# Altium project gilbertcell_TEST_V1.PrjPcb
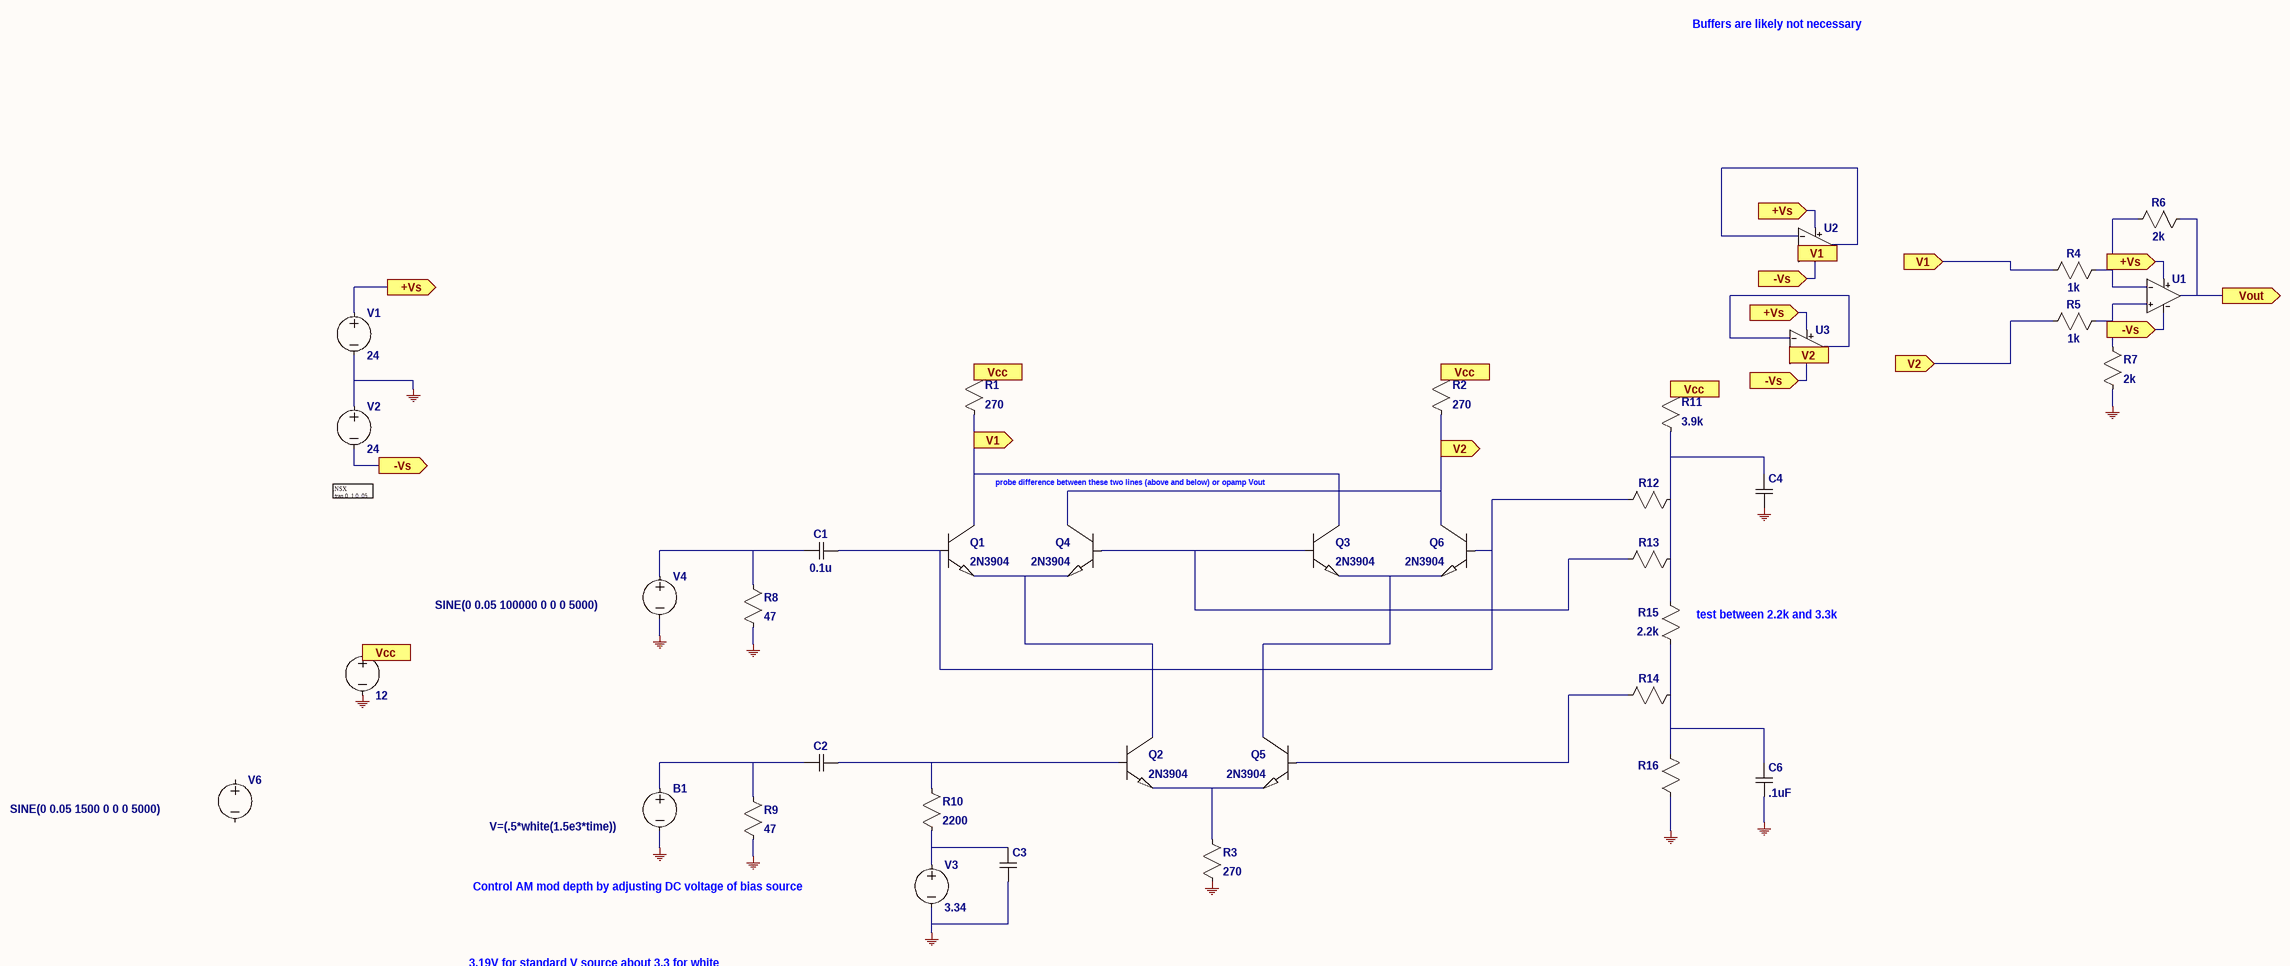
[diagram p0: gilbertcell_TEST_V1.SchDoc]
1 sheet, 37 parts. Net scope: flat (ports and power ports of the same name join across sheets).
Board file: RADIO.PcbDoc

## Sheet gilbertcell_TEST_V1.SchDoc
size 1141 x 419 mm

### Parts
B1  V=(.5*white(1.5e3*time))
C1  0.1u
C2  0.1u  (value not drawn)
C3  0.1u  (value not drawn)
C4  0.1u  (value not drawn)
C6  .1uF
Q1  2N3904
Q2  2N3904
Q3  2N3904
Q4  2N3904
Q5  2N3904
Q6  2N3904
R1  270
R2  270
R3  270
R4  1k
R5  1k
R6  2k
R7  2k
R8  47
R9  47
R10  2200
R11  3.9k
R12  2200  (value not drawn)
R13  2200  (value not drawn)
R14  2200  (value not drawn)
R15  2.2k
R16  2200  (value not drawn)
U1  Value  (value not drawn)
U2  Value  (value not drawn)
U3  Value  (value not drawn)
V1  24
V2  24
V3  3.34
V4  SINE(0 0.05 100000 0 0 0 5000)
V5  12
V6  SINE(0 0.05 1500 0 0 0 5000)

### Ports
+Vs (in), +Vs (out), -Vs (in), -Vs (out), V1 (in), V1 (out), V2 (in), V2 (out), Vcc (in), Vcc (out), Vout (out)

### Nets
GND: B1.2(-) C3.2(B) C4.2(B) C6.2(B) R3.2(B) R7.2(B) R8.2(B) R9.2(B) R16.1(A) V1.2(-) V2.1(+) V3.2(-) V4.2(-) V5.2(-)
NetB1_1: B1.1(+) C2.2(B) R9.1(A)
NetC1_1: C1.1(A) Q1.2(B) Q6.2(B) R12.2(B)
NetC1_2: C1.2(B) R8.1(A) V4.1(+)
NetC2_1: C2.1(A) Q2.2(B) R10.1(A)
NetC3_1: C3.1(A) R10.2(B) V3.1(+)
NetC4_1: C4.1(A) R11.2(B) R12.1(A) R13.1(A) R15.2(B)
NetC6_1: C6.1(A) R14.1(A) R15.1(A) R16.2(B)
NetQ1_1: Q1.1(C) Q3.1(C) R1.2(B) R4.2(B) U2.1(In+) ; port V1
NetQ1_3: Q1.3(E) Q2.1(C) Q4.3(E)
NetQ2_3: Q2.3(E) Q5.3(E) R3.1(A)
NetQ3_2: Q3.2(B) Q4.2(B) R13.2(B)
NetQ3_3: Q3.3(E) Q5.1(C) Q6.3(E)
NetQ4_1: Q4.1(C) Q6.1(C) R2.2(B) R5.2(B) U3.1(In+) ; port V2
NetQ5_2: Q5.2(B) R14.2(B)
NetR1_1: R1.1(A) R2.1(A) R11.1(A) V5.1(+) ; port Vcc
NetR4_1: R4.1(A) R6.2(B) U1.2(In-)
NetR5_1: R5.1(A) R7.1(A) U1.1(In+)
NetR6_1: R6.1(A) U1.5(OUT) ; port Vout
NetU1_3: U1.3(V+) U2.3(V+) U3.3(V+) V1.1(+) ; port +Vs
NetU1_4: U1.4(V-) U2.4(V-) U3.4(V-) V2.2(-) ; port -Vs
NetU2_2: U2.2(In-) U2.5(OUT)
NetU3_2: U3.2(In-) U3.5(OUT)

Not connected (* = marked no-connect by the designer): V6 1(+) 2(-)

### Notes on the sheet
- Buffers are likely not necessary
- probe difference between these two lines (above and below) or opamp Vout
- .NSX
  .tran 0 .1 0 .05
- (near R15) test between 2.2k and 3.3k
- Control AM mod depth by adjusting DC voltage of bias source
- 3.19V for standard V source
  about 3.3 for white

### Library data of the parts
B1 = bv: V= voltage source; InstName: B1; Prefix: B; Value: V=(.5*white(1.5e3*time))
C1 = cap-0.1u: InstName: C1; Prefix: C; Value: 0.1u
C2 = cap-0.1u: InstName: C2; Prefix: C; Value: 0.1u
C3 = cap-0.1u: InstName: C3; Prefix: C; Value: 0.1u
C4 = cap-0.1u: InstName: C4; Prefix: C; Value: 0.1u
C6 = cap-.1uF: InstName: C6; Prefix: C; Value: .1uF
Q1 = npn-2N3904: InstName: Q1; Prefix: QN; Value: 2N3904
Q2 = npn-2N3904: InstName: Q2; Prefix: QN; Value: 2N3904
Q3 = npn-2N3904: InstName: Q3; Prefix: QN; Value: 2N3904
Q4 = npn-2N3904: InstName: Q4; Prefix: QN; Value: 2N3904
Q5 = npn-2N3904: InstName: Q5; Prefix: QN; Value: 2N3904
Q6 = npn-2N3904: InstName: Q6; Prefix: QN; Value: 2N3904
R1 = res-270: InstName: R1; Prefix: R; Value: 270
R2 = res-270: InstName: R2; Prefix: R; Value: 270
R3 = res-270: InstName: R3; Prefix: R; Value: 270
R4 = res-1k: InstName: R4; Prefix: R; Value: 1k
R5 = res-1k: InstName: R5; Prefix: R; Value: 1k
R6 = res-2k: InstName: R6; Prefix: R; Value: 2k
R7 = res-2k: InstName: R7; Prefix: R; Value: 2k
R8 = res-47: InstName: R8; Prefix: R; Value: 47
R9 = res-47: InstName: R9; Prefix: R; Value: 47
R10 = res-2200: InstName: R10; Prefix: R; Value: 2200
R11 = res-3.9k: InstName: R11; Prefix: R; Value: 3.9k
R12 = res-2200: InstName: R12; Prefix: R; Value: 2200
R13 = res-2200: InstName: R13; Prefix: R; Value: 2200
R14 = res-2200: InstName: R14; Prefix: R; Value: 2200
R15 = res-2.2k: InstName: R15; Prefix: R; Value: 2.2k
R16 = res-2200: InstName: R16; Prefix: R; Value: 2200
U1 = UniversalOpAmp: InstName: U1; Prefix: X; Value2: Avol=1Meg GBW=10Meg Vos=0; ModelFile: UniversalOpAmp1.lib; Value: Value; SpiceModel: level1; SpiceLine: En=0 Enk=0 In=0 Ink=0 Rin=500Meg
U2 = UniversalOpAmp: InstName: U2; Prefix: X; Value2: Avol=1Meg GBW=10Meg Vos=0; ModelFile: UniversalOpAmp1.lib; Value: Value; SpiceModel: level1; SpiceLine: En=0 Enk=0 In=0 Ink=0 Rin=500Meg
U3 = UniversalOpAmp: InstName: U3; Prefix: X; Value2: Avol=1Meg GBW=10Meg Vos=0; ModelFile: UniversalOpAmp1.lib; Value: Value; SpiceModel: level1; SpiceLine: En=0 Enk=0 In=0 Ink=0 Rin=500Meg
V1 = voltage-24: voltage source; InstName: V1; Prefix: V; Value: 24
V2 = voltage-24: voltage source; InstName: V2; Prefix: V; Value: 24
V3 = voltage-3.34: voltage source; InstName: V3; Prefix: V; Value: 3.34
V4 = voltage: SINE voltage source; InstName: V4; Prefix: V; Value: SINE(0 0.05 100000 0 0 0 5000)
V5 = voltage-12: voltage source; InstName: V5; Prefix: V; Value: 12
V6 = voltage: SINE voltage source; InstName: V6; Prefix: V; Value: SINE(0 0.05 1500 0 0 0 5000)